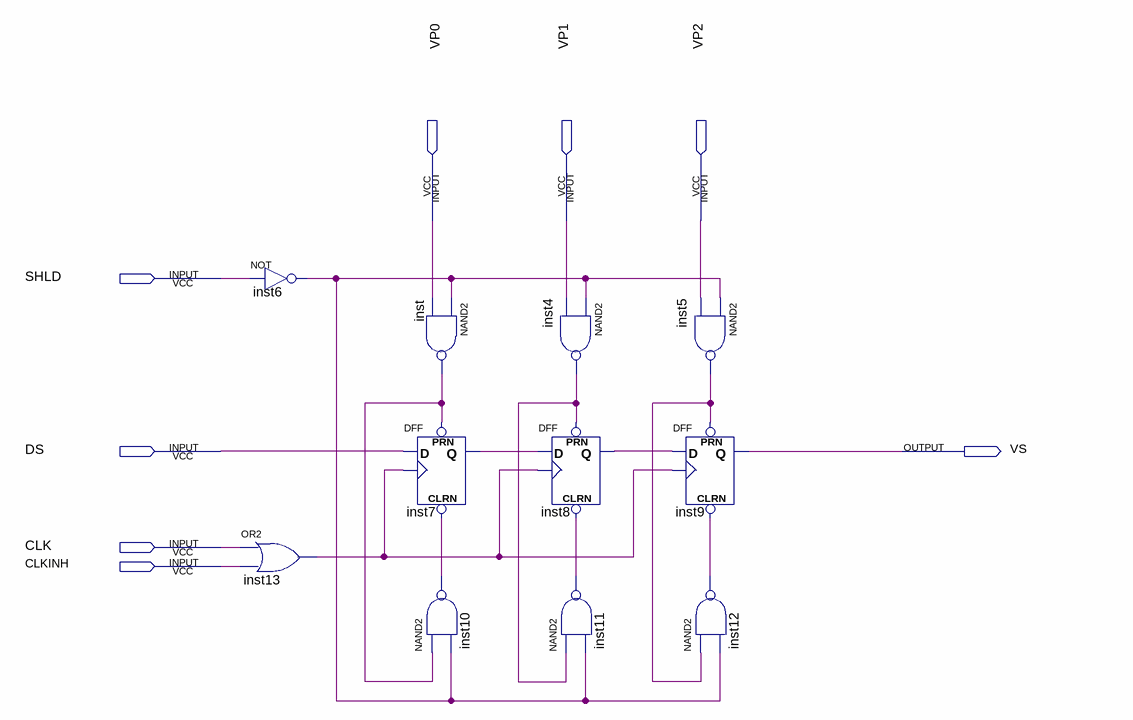
[diagram p0: schematic sheet]
// Quartus schematic Register_Paralelo_Serial.bdf as structural Verilog: 11 symbols, 8 pins
module Register_Paralelo_Serial (
  input  VP0,
  input  VP1,
  input  VP2,
  input  SHLD,
  input  DS,
  input  CLK,
  input  CLKINH,
  output VS
);

  wire inst4_out, inst5_out, inst6_out, inst7_q, inst8_q, inst10_out, inst11_out, inst12_out, inst13_out,
       inst_out;

  not inst6 (inst6_out, SHLD);
  or inst13 (inst13_out, CLK, CLKINH);
  nand inst (inst_out, inst6_out, VP0);
  DFF inst7 (.CLRN(inst10_out), .CLK(inst13_out), .D(DS), .PRN(inst_out), .Q(inst7_q));
  nand inst10 (inst10_out, inst_out, inst6_out);
  DFF inst8 (.CLRN(inst11_out), .CLK(inst13_out), .D(inst7_q), .PRN(inst4_out), .Q(inst8_q));
  nand inst4 (inst4_out, inst6_out, VP1);
  nand inst11 (inst11_out, inst4_out, inst6_out);
  nand inst5 (inst5_out, inst6_out, VP2);
  DFF inst9 (.CLRN(inst12_out), .CLK(inst13_out), .D(inst8_q), .PRN(inst5_out), .Q(VS));
  nand inst12 (inst12_out, inst5_out, inst6_out);
endmodule
